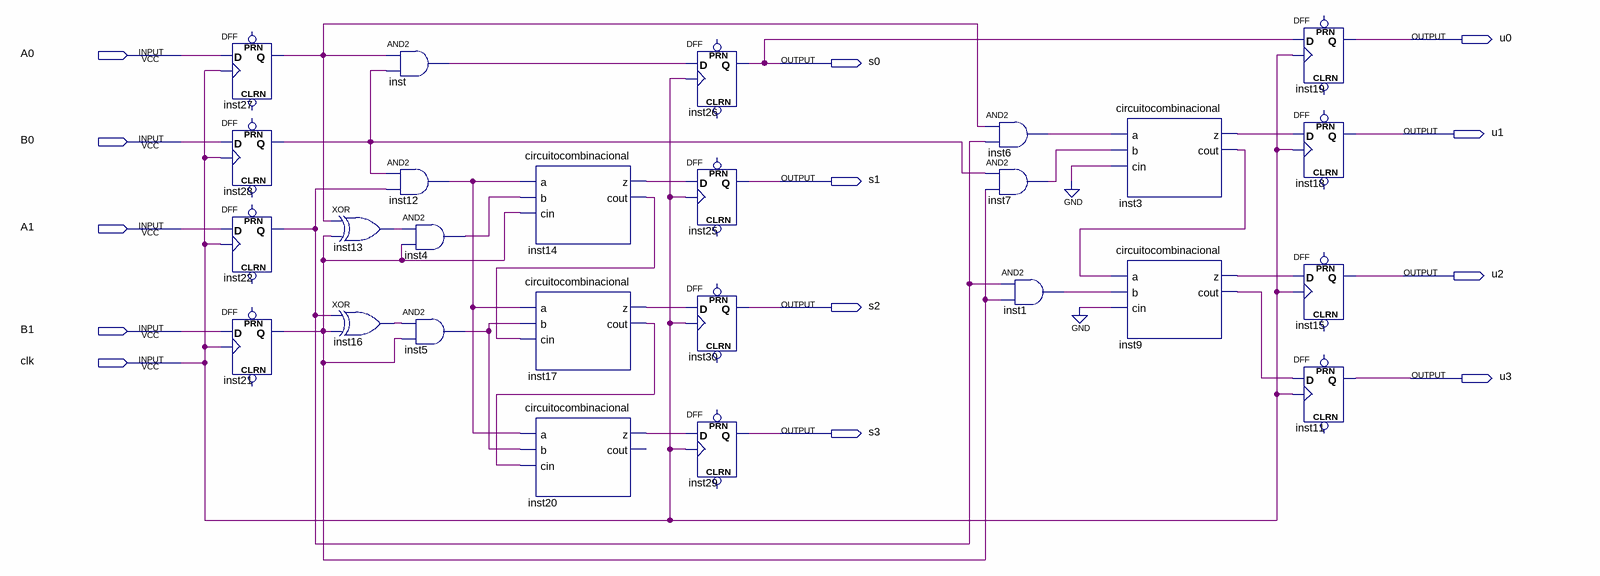
[diagram p0: schematic sheet]
// Quartus schematic MultiModyCA2.bdf as structural Verilog: 26 symbols, 13 pins
module MultiModyCA2 (
  input  A0,
  input  B0,
  input  A1,
  input  B1,
  input  clk,
  output u0,
  output s0,
  output u1,
  output s1,
  output u2,
  output s2,
  output u3,
  output s3
);

  wire inst1_out, inst3_cout, inst3_z, inst4_out, inst5_out, inst6_out, inst7_out, inst9_cout, inst9_z,
       inst12_out, inst13_out, inst14_cout, inst14_z, inst16_out, inst17_cout, inst17_z, inst20_z, inst21_q,
       inst22_q, inst27_q, inst28_q, inst_out;

  DFF inst27 (.CLK(clk), .D(A0), .Q(inst27_q));  // open: CLRN, PRN
  DFF inst28 (.CLK(clk), .D(B0), .Q(inst28_q));  // open: CLRN, PRN
  DFF inst22 (.CLK(clk), .D(A1), .Q(inst22_q));  // open: CLRN, PRN
  DFF inst21 (.CLK(clk), .D(B1), .Q(inst21_q));  // open: CLRN, PRN
  xor inst13 (inst13_out, inst27_q, inst21_q);
  xor inst16 (inst16_out, inst22_q, inst21_q);
  and inst (inst_out, inst27_q, inst28_q);
  and inst12 (inst12_out, inst28_q, inst22_q);
  and inst4 (inst4_out, inst13_out, inst21_q);
  and inst5 (inst5_out, inst16_out, inst21_q);
  circuitocombinacional inst14 (.a(inst12_out), .b(inst4_out), .cin(inst21_q), .z(inst14_z), .cout(inst14_cout));
  circuitocombinacional inst17 (.a(inst12_out), .b(inst5_out), .cin(inst14_cout), .z(inst17_z), .cout(inst17_cout));
  circuitocombinacional inst20 (.a(inst12_out), .b(inst5_out), .cin(inst17_cout), .z(inst20_z));  // open: cout
  DFF inst26 (.CLK(clk), .D(inst_out), .Q(s0));  // open: CLRN, PRN
  DFF inst25 (.CLK(clk), .D(inst14_z), .Q(s1));  // open: CLRN, PRN
  DFF inst30 (.CLK(clk), .D(inst17_z), .Q(s2));  // open: CLRN, PRN
  DFF inst29 (.CLK(clk), .D(inst20_z), .Q(s3));  // open: CLRN, PRN
  and inst6 (inst6_out, inst27_q, inst22_q);
  and inst7 (inst7_out, inst28_q, inst21_q);
  and inst1 (inst1_out, inst22_q, inst21_q);
  circuitocombinacional inst3 (.a(inst6_out), .b(inst7_out), .cin(1'b0), .z(inst3_z), .cout(inst3_cout));
  circuitocombinacional inst9 (.a(inst3_cout), .b(inst1_out), .cin(1'b0), .z(inst9_z), .cout(inst9_cout));
  DFF inst19 (.CLK(clk), .D(s0), .Q(u0));  // open: CLRN, PRN
  DFF inst18 (.CLK(clk), .D(inst3_z), .Q(u1));  // open: CLRN, PRN
  DFF inst15 (.CLK(clk), .D(inst9_z), .Q(u2));  // open: CLRN, PRN
  DFF inst11 (.CLK(clk), .D(inst9_cout), .Q(u3));  // open: CLRN, PRN
endmodule
